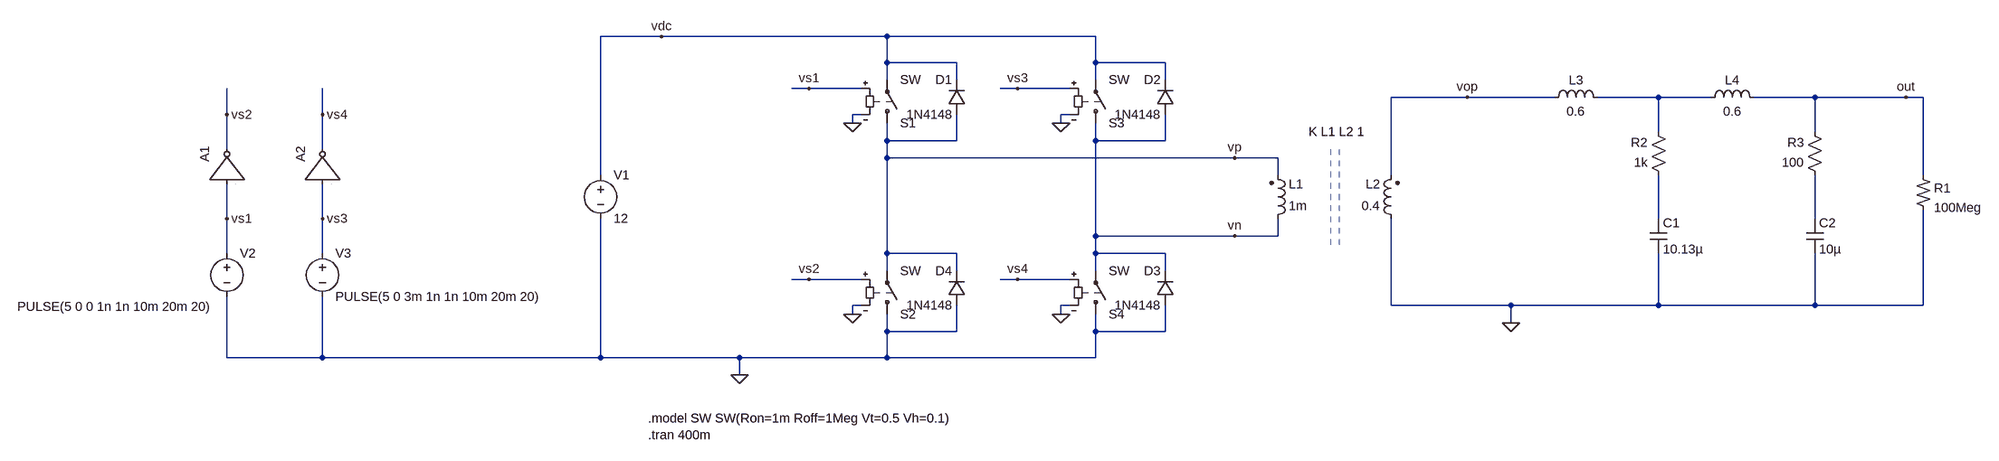
[diagram p0: schematic single-phase-inverter_v1p1.asc]
single-phase-inverter_v1p1.asc, the LTspice schematic file:
Version 4
SHEET 1 2224 844
WIRE -224 96 -336 96
WIRE 192 96 -224 96
WIRE 576 96 192 96
WIRE 192 144 192 96
WIRE 320 144 192 144
WIRE 576 144 576 96
WIRE 704 144 576 144
WIRE 192 176 192 144
WIRE 320 176 320 144
WIRE 576 176 576 144
WIRE 704 176 704 144
WIRE 48 192 16 192
WIRE 144 192 48 192
WIRE 432 192 400 192
WIRE 528 192 432 192
WIRE 1264 208 1120 208
WIRE 1424 208 1264 208
WIRE 1616 208 1504 208
WIRE 1712 208 1616 208
WIRE 1904 208 1792 208
WIRE 2080 208 1904 208
WIRE 2112 208 2080 208
WIRE -1024 240 -1024 192
WIRE -848 240 -848 192
WIRE 144 240 128 240
WIRE 528 240 512 240
WIRE 128 256 128 240
WIRE 512 256 512 240
WIRE 1616 272 1616 208
WIRE 1904 272 1904 208
WIRE 192 288 192 256
WIRE 320 288 320 240
WIRE 320 288 192 288
WIRE 576 288 576 256
WIRE 704 288 704 240
WIRE 704 288 576 288
WIRE -1024 304 -1024 240
WIRE -848 304 -848 240
WIRE 192 320 192 288
WIRE 832 320 192 320
WIRE 912 320 832 320
WIRE -336 352 -336 96
WIRE 912 352 912 320
WIRE 1120 352 1120 208
WIRE 2112 352 2112 208
WIRE -1024 432 -1024 368
WIRE -848 432 -848 368
WIRE 1616 432 1616 352
WIRE 1904 432 1904 352
WIRE 576 464 576 288
WIRE 832 464 576 464
WIRE 912 464 912 432
WIRE 912 464 832 464
WIRE -1024 496 -1024 432
WIRE -848 496 -848 432
WIRE 192 496 192 320
WIRE 320 496 192 496
WIRE 576 496 576 464
WIRE 704 496 576 496
WIRE 192 528 192 496
WIRE 320 528 320 496
WIRE 576 528 576 496
WIRE 704 528 704 496
WIRE 48 544 16 544
WIRE 144 544 48 544
WIRE 432 544 400 544
WIRE 528 544 432 544
WIRE 144 592 128 592
WIRE 528 592 512 592
WIRE 1120 592 1120 432
WIRE 1344 592 1120 592
WIRE 1616 592 1616 496
WIRE 1616 592 1344 592
WIRE 1904 592 1904 496
WIRE 1904 592 1616 592
WIRE 2112 592 2112 416
WIRE 2112 592 1904 592
WIRE 128 608 128 592
WIRE 512 608 512 592
WIRE 1344 624 1344 592
WIRE 192 640 192 608
WIRE 320 640 320 592
WIRE 320 640 192 640
WIRE 576 640 576 608
WIRE 704 640 704 592
WIRE 704 640 576 640
WIRE -1024 688 -1024 576
WIRE -848 688 -848 576
WIRE -848 688 -1024 688
WIRE -336 688 -336 432
WIRE -336 688 -848 688
WIRE -80 688 -336 688
WIRE 192 688 192 640
WIRE 192 688 -80 688
WIRE 576 688 576 640
WIRE 576 688 192 688
WIRE -80 720 -80 688
FLAG 512 256 0
FLAG 512 608 0
FLAG 128 608 0
FLAG 128 256 0
FLAG -1024 432 vs1
FLAG -848 432 vs3
FLAG -1024 240 vs2
FLAG -848 240 vs4
FLAG 48 192 vs1
FLAG 48 544 vs2
FLAG 432 192 vs3
FLAG 432 544 vs4
FLAG -80 720 0
FLAG 832 320 vp
FLAG 832 464 vn
FLAG 1264 208 vop
FLAG 1344 624 0
FLAG -224 96 vdc
FLAG 2080 208 out
SYMBOL sw 192 272 M180
SYMATTR InstName S1
SYMBOL sw 192 624 M180
SYMATTR InstName S2
SYMBOL sw 576 272 M180
SYMATTR InstName S3
SYMBOL sw 576 624 M180
SYMATTR InstName S4
SYMBOL voltage -336 336 R0
SYMATTR InstName V1
SYMATTR Value 12
SYMATTR SpiceLine Rser=1m
SYMBOL ind2 896 448 M180
WINDOW 0 36 80 Left 2
WINDOW 3 36 40 Left 2
SYMATTR InstName L1
SYMATTR Value 1m
SYMBOL ind2 1136 448 R180
WINDOW 0 36 80 Left 2
WINDOW 3 36 40 Left 2
SYMATTR InstName L2
SYMATTR Value 0.4
SYMBOL diode 336 240 R180
WINDOW 0 24 64 Left 2
WINDOW 3 24 0 Left 2
SYMATTR InstName D1
SYMATTR Value 1N4148
SYMBOL diode 720 240 R180
WINDOW 0 24 64 Left 2
WINDOW 3 24 0 Left 2
SYMATTR InstName D2
SYMATTR Value 1N4148
SYMBOL diode 720 592 R180
WINDOW 0 24 64 Left 2
WINDOW 3 24 0 Left 2
SYMATTR InstName D3
SYMATTR Value 1N4148
SYMBOL diode 336 592 R180
WINDOW 0 24 64 Left 2
WINDOW 3 24 0 Left 2
SYMATTR InstName D4
SYMATTR Value 1N4148
SYMBOL res2 2096 352 R0
SYMATTR InstName R1
SYMATTR Value 100Meg
SYMBOL voltage -1024 480 R0
WINDOW 3 -386 114 Left 2
WINDOW 123 0 0 Left 0
WINDOW 39 0 0 Left 0
SYMATTR Value PULSE(5 0 0 1n 1n 10m 20m 20)
SYMATTR InstName V2
SYMBOL voltage -848 480 R0
WINDOW 123 0 0 Left 0
WINDOW 39 0 0 Left 0
SYMATTR InstName V3
SYMATTR Value PULSE(5 0 3m 1n 1n 10m 20m 20)
SYMBOL inv -1088 368 R270
SYMATTR InstName A1
SYMATTR SpiceLine VHIGH=5
SYMBOL inv -912 368 R270
SYMATTR InstName A2
SYMATTR SpiceLine VHIGH=5
SYMBOL ind 1408 224 R270
WINDOW 0 32 56 VTop 2
WINDOW 3 5 56 VBottom 2
SYMATTR InstName L3
SYMATTR Value 0.6
SYMATTR SpiceLine Rser=1m
SYMBOL cap 1600 432 R0
SYMATTR InstName C1
SYMATTR Value 10.13µ
SYMBOL res 1632 368 R180
WINDOW 0 36 76 Left 2
WINDOW 3 36 40 Left 2
SYMATTR InstName R2
SYMATTR Value 1k
SYMBOL ind 1696 224 R270
WINDOW 0 32 56 VTop 2
WINDOW 3 5 56 VBottom 2
SYMATTR InstName L4
SYMATTR Value 0.6
SYMATTR SpiceLine Rser=1m
SYMBOL cap 1888 432 R0
SYMATTR InstName C2
SYMATTR Value 10µ
SYMBOL res 1920 368 R180
WINDOW 0 36 76 Left 2
WINDOW 3 36 40 Left 2
SYMATTR InstName R3
SYMATTR Value 100
TEXT -248 800 Left 2 !.model SW SW(Ron=1m Roff=1Meg Vt=0.5 Vh=0.1)\n.tran 400m
TEXT 968 272 Left 2 !K L1 L2 1
LINE Normal 1008 304 1008 480 2
LINE Normal 1024 304 1024 480 2

The netlist it stands for:
* single-phase-inverter_v1p1.asc
S1 vp vdc vs1 0 SW
S2 0 vp vs2 0 SW
S3 vn vdc vs3 0 SW
S4 0 vn vs4 0 SW
V1 vdc 0 12 Rser=1m
L1 vn vp 1m
L2 0 vop 0.4
D1 vp vdc 1N4148
D2 vn vdc 1N4148
D3 0 vn 1N4148
D4 0 vp 1N4148
R1 out 0 100Meg
V2 vs1 0 PULSE(5 0 0 1n 1n 10m 20m 20)
V3 vs3 0 PULSE(5 0 3m 1n 1n 10m 20m 20)
A1 vs1 0 0 0 0 vs2 0 0 BUF VHIGH=5
A2 vs3 0 0 0 0 vs4 0 0 BUF VHIGH=5
L3 vop N001 0.6 Rser=1m
C1 N002 0 10.13µ
R2 N002 N001 1k
L4 N001 out 0.6 Rser=1m
C2 N003 0 10µ
R3 N003 out 100
.model D D
.lib standard.dio
.model SW SW(Ron=1m Roff=1Meg Vt=0.5 Vh=0.1)
.tran 400m
K L1 L2 1
.backanno
.end